# EAGLE schematic 12T_GAUGE_INPUT (EAGLE 9.1.3)
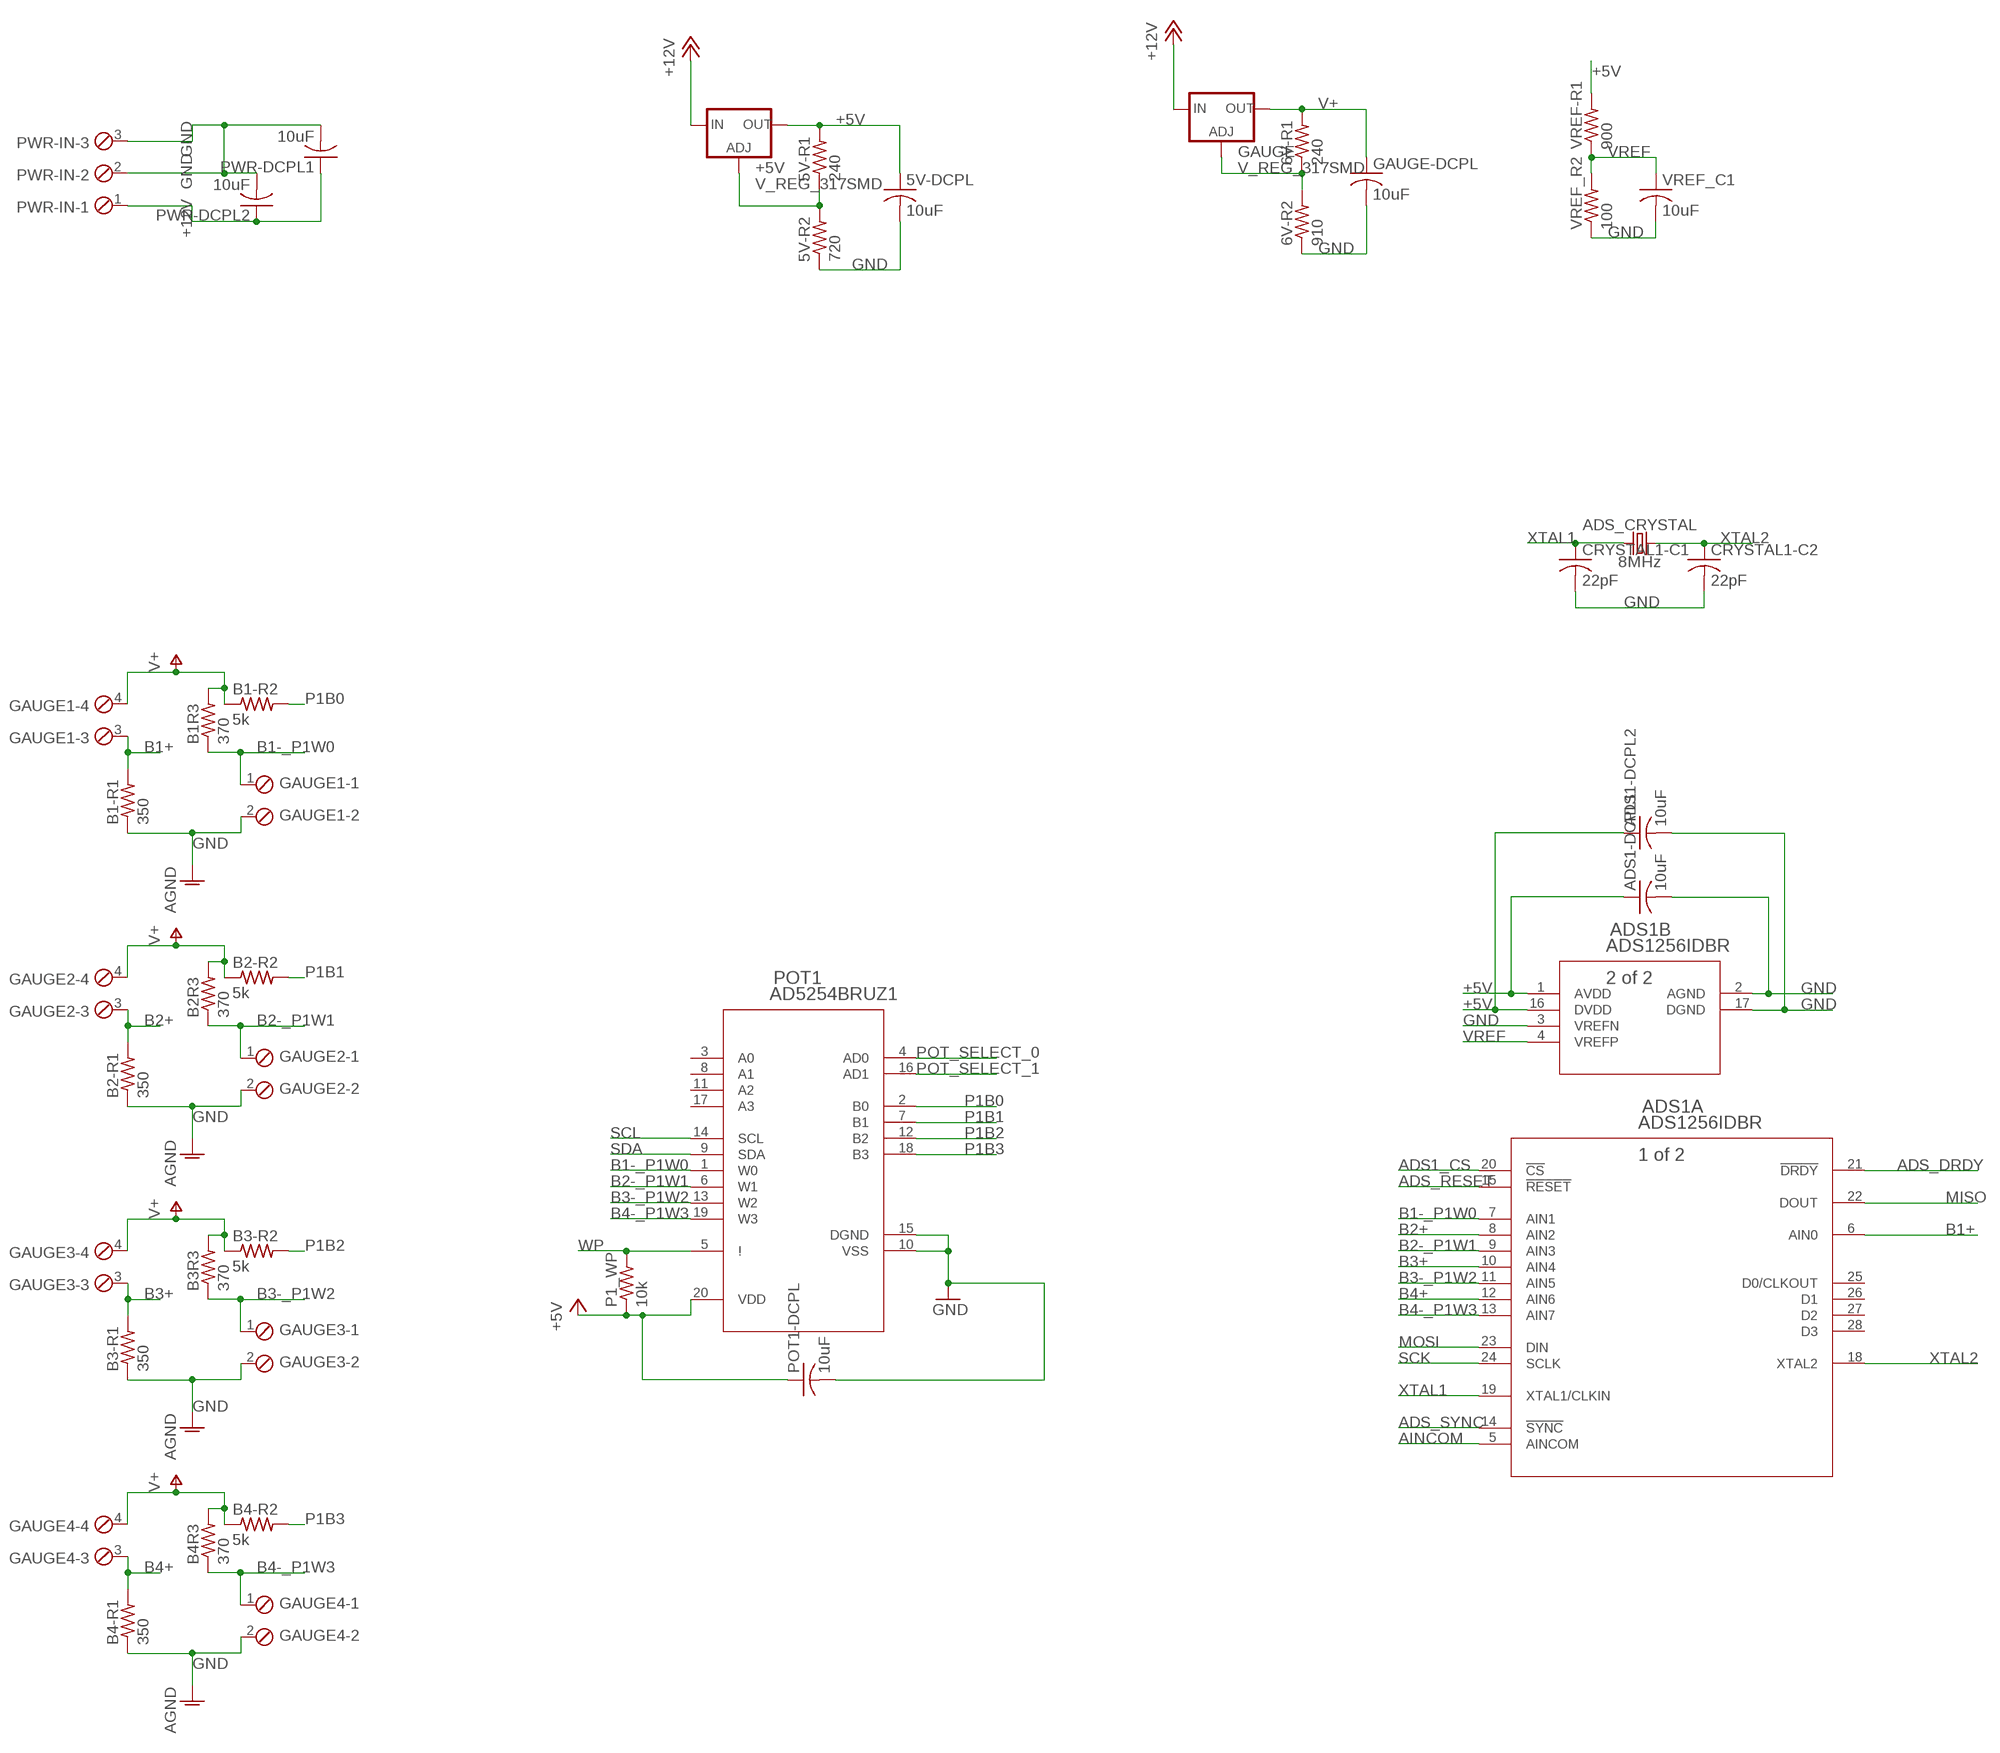
[diagram p0: schematic, sheet 1, part 1 of 3]
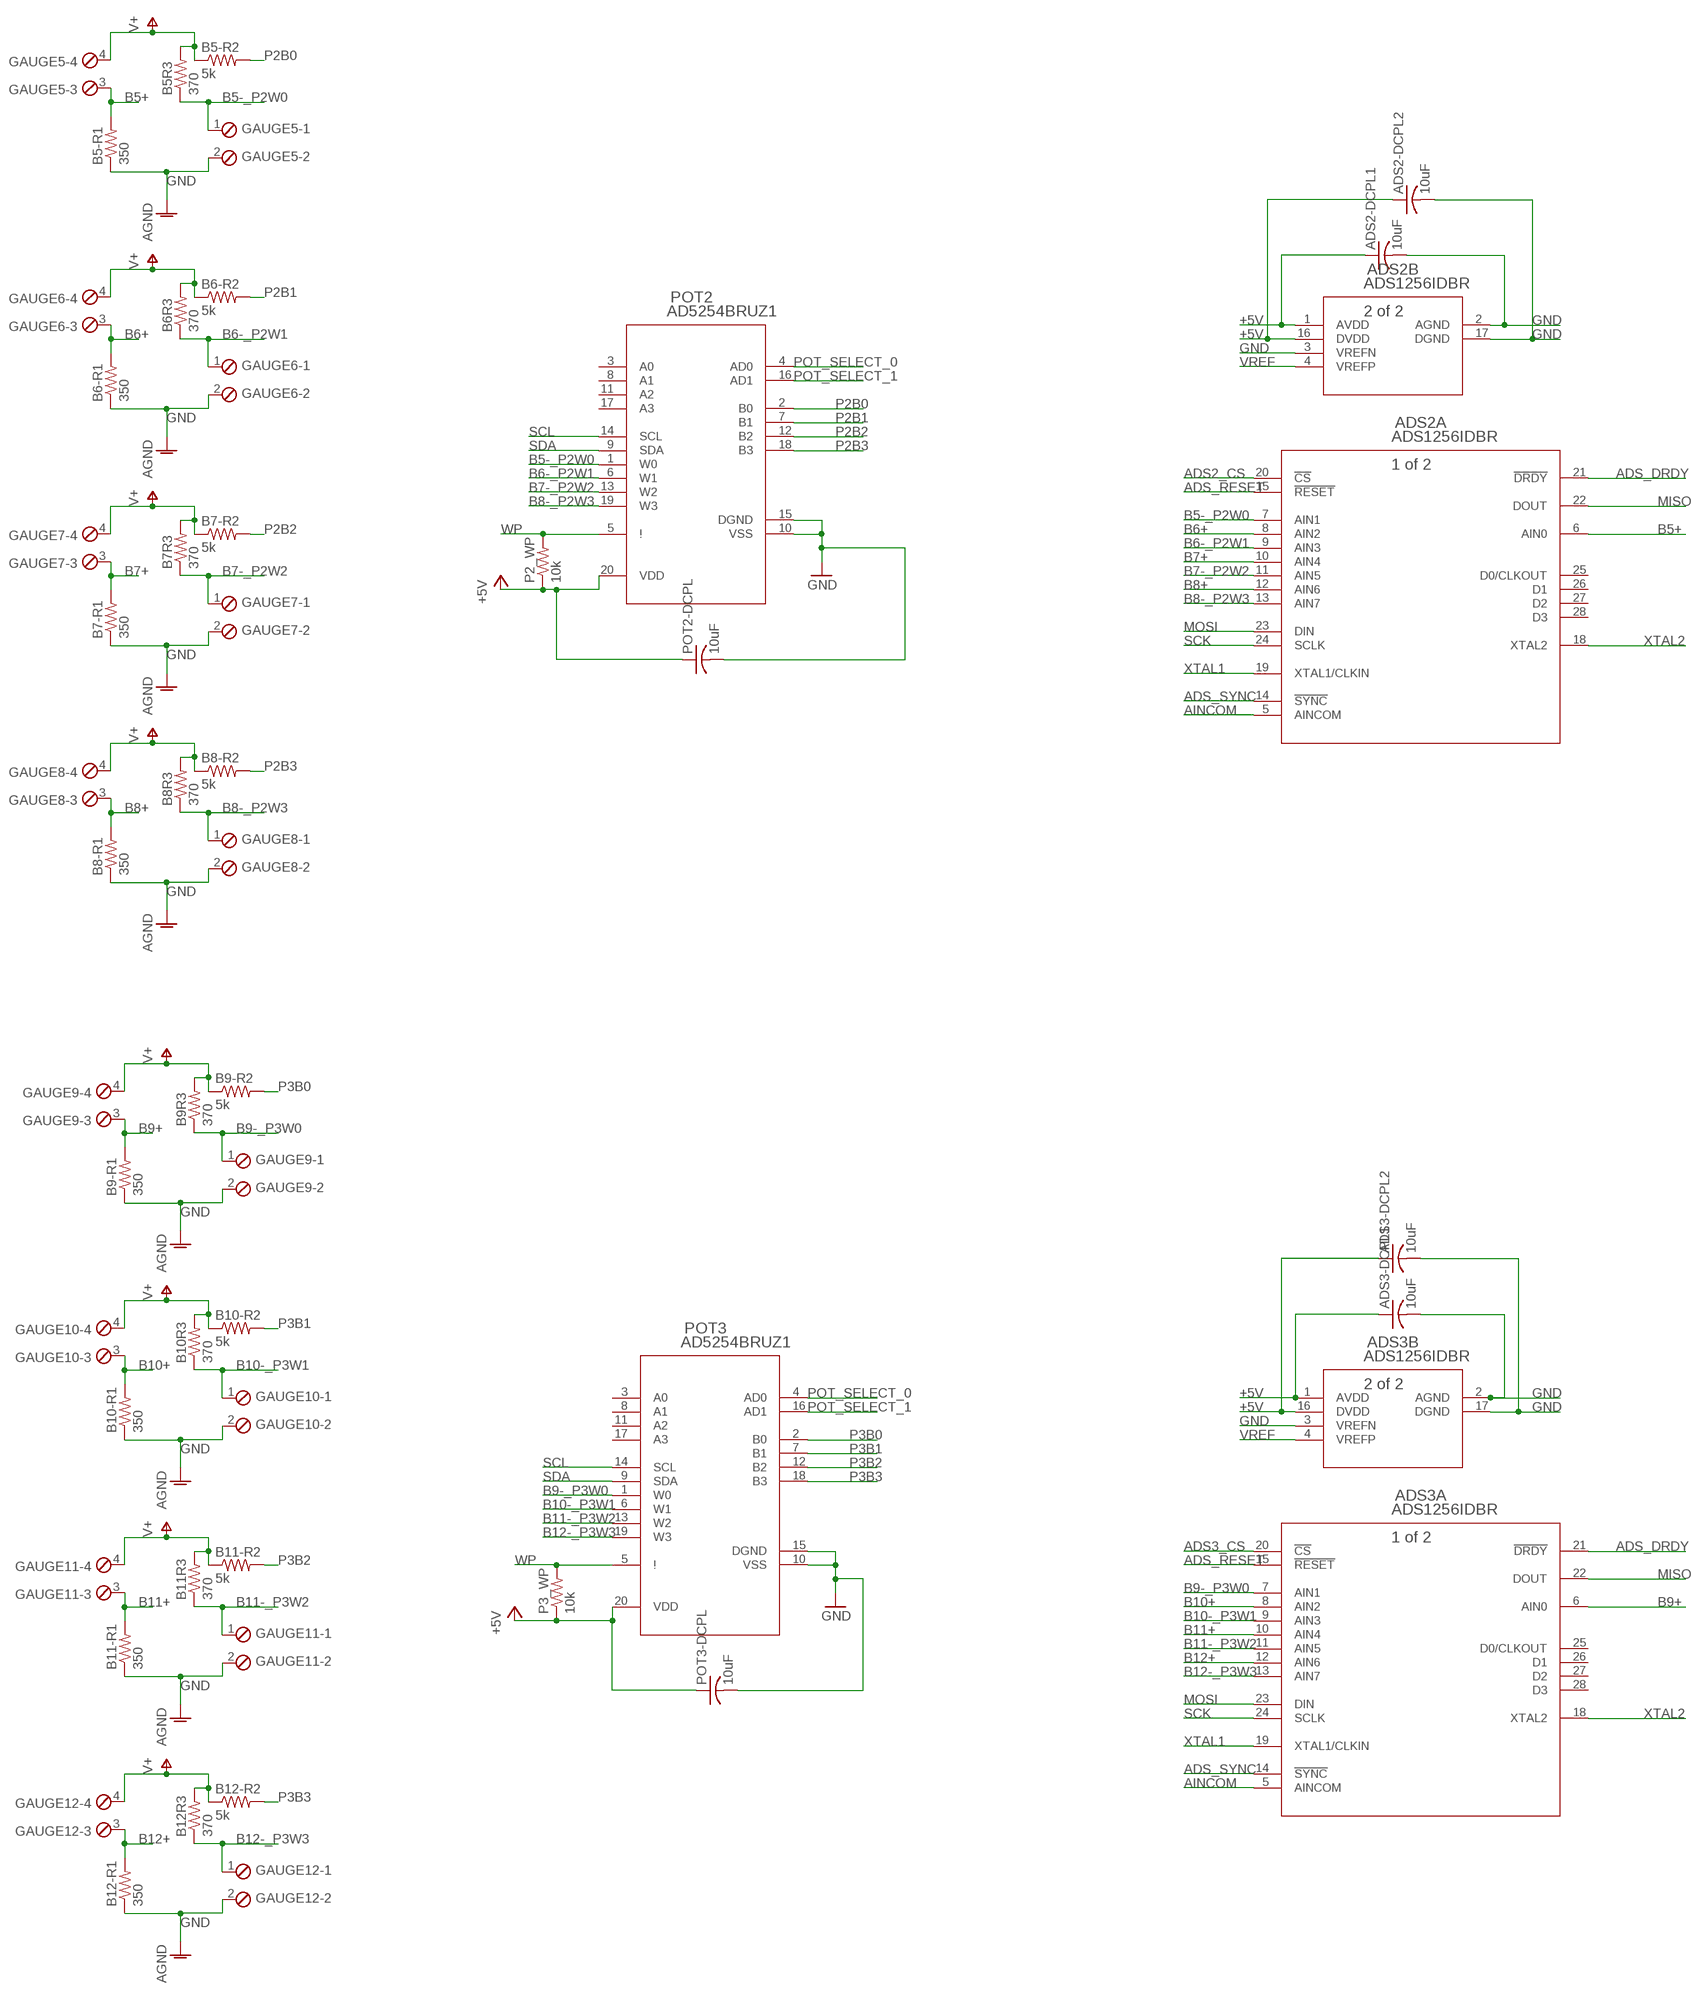
[diagram p1: schematic, sheet 1, part 2 of 3]
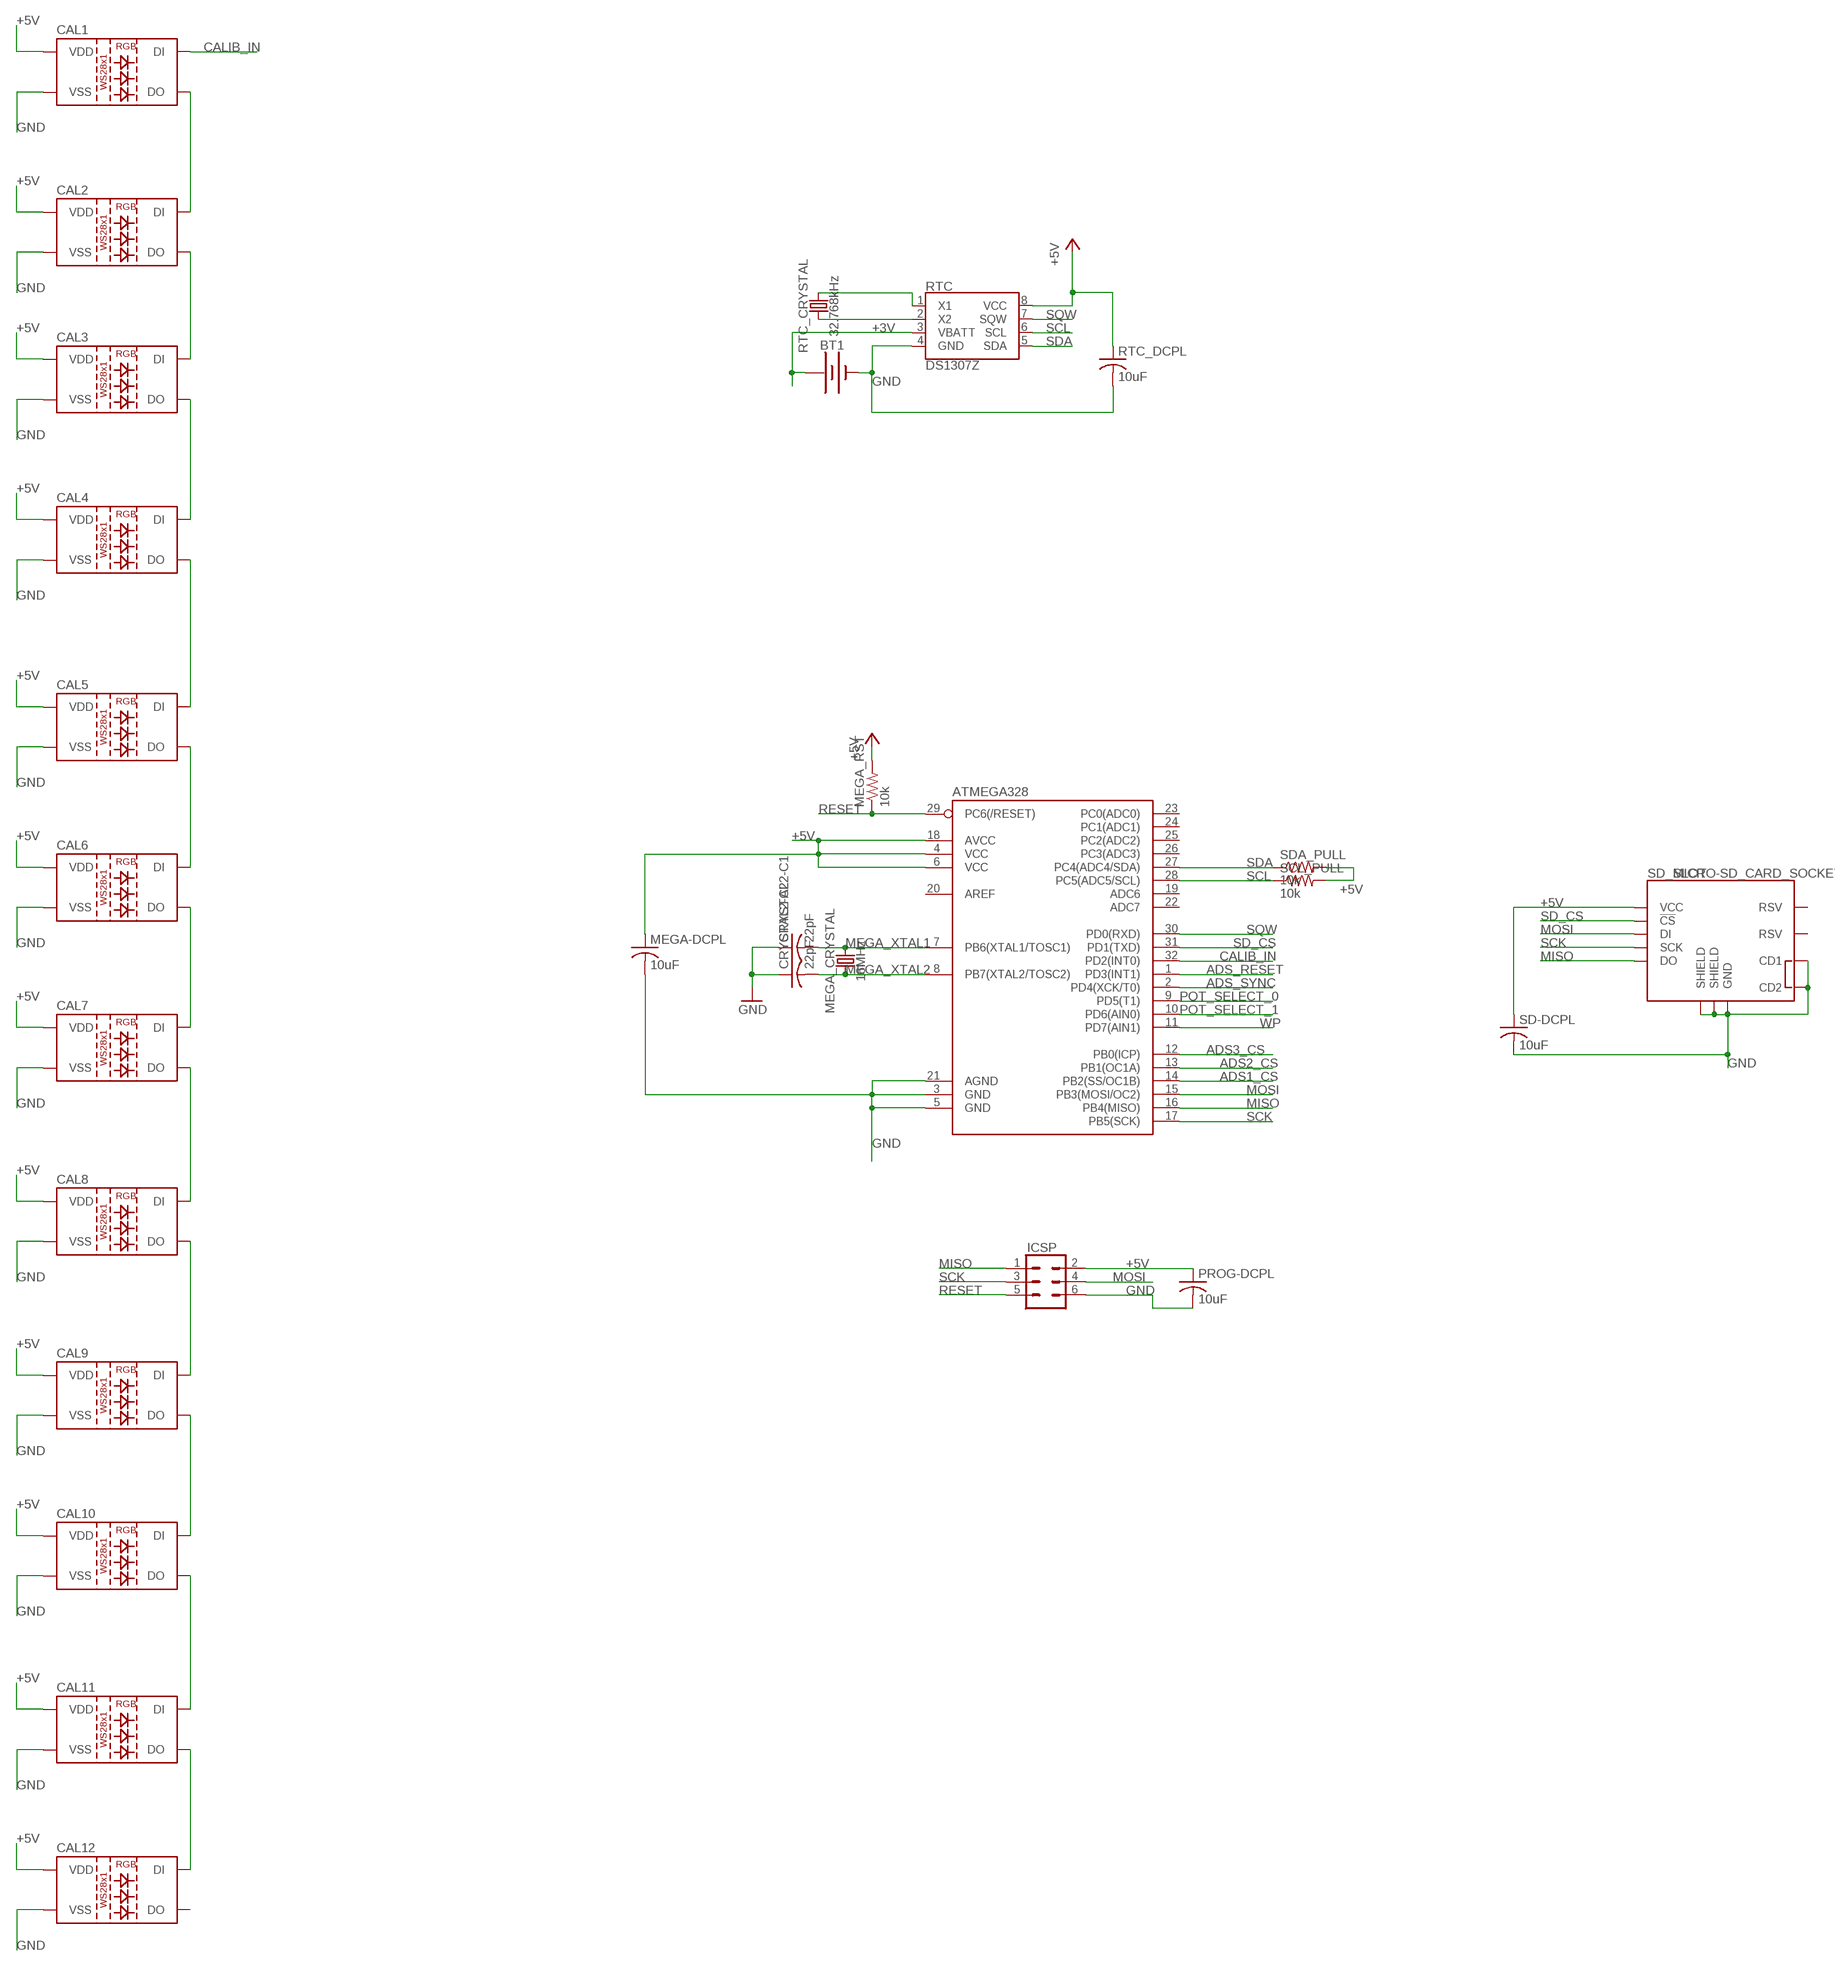
[diagram p2: schematic, sheet 1, part 3 of 3]

## Parts
5V-DCPL  10uF  C-USC1206  [C1206]
5V-R1  240  R-US_R1206  [R1206]
5V-R2  720  R-US_R1206  [R1206]
6V-R1  240  R-US_R1206  [R1206]
6V-R2  910  R-US_R1206  [R1206]
+5V  V_REG_317SMD  [SOT223]
ADS1  ADS1256IDBR  [DB28]
ADS1-DCPL1  10uF  C-USC1206  [C1206]
ADS1-DCPL2  10uF  C-USC1206  [C1206]
ADS2  ADS1256IDBR  [DB28]
ADS2-DCPL1  10uF  C-USC1206  [C1206]
ADS2-DCPL2  10uF  C-USC1206  [C1206]
ADS3  ADS1256IDBR  [DB28]
ADS3-DCPL1  10uF  C-USC1206  [C1206]
ADS3-DCPL2  10uF  C-USC1206  [C1206]
ADS_CRYSTAL  8MHz  CRYSTAL-8MHZSMD-5X3.2  [CRYSTAL-SMD-5X3.2-4PAD]
ATMEGA328  ATMEGA328P_TQFP  [TQFP32-08]
B1-R1  350  R-US_R1206  [R1206]
B1-R2  5k  R-US_R1206  [R1206]
B1R3  370  R-US_R1206  [R1206]
B2-R1  350  R-US_R1206  [R1206]
B2-R2  5k  R-US_R1206  [R1206]
B2R3  370  R-US_R1206  [R1206]
B3-R1  350  R-US_R1206  [R1206]
B3-R2  5k  R-US_R1206  [R1206]
B3R3  370  R-US_R1206  [R1206]
B4-R1  350  R-US_R1206  [R1206]
B4-R2  5k  R-US_R1206  [R1206]
B4R3  370  R-US_R1206  [R1206]
B5-R1  350  R-US_R1206  [R1206]
B5-R2  5k  R-US_R1206  [R1206]
B5R3  370  R-US_R1206  [R1206]
B6-R1  350  R-US_R1206  [R1206]
B6-R2  5k  R-US_R1206  [R1206]
B6R3  370  R-US_R1206  [R1206]
B7-R1  350  R-US_R1206  [R1206]
B7-R2  5k  R-US_R1206  [R1206]
B7R3  370  R-US_R1206  [R1206]
B8-R1  350  R-US_R1206  [R1206]
B8-R2  5k  R-US_R1206  [R1206]
B8R3  370  R-US_R1206  [R1206]
B9-R1  350  R-US_R1206  [R1206]
B9-R2  5k  R-US_R1206  [R1206]
B9R3  370  R-US_R1206  [R1206]
B10-R1  350  R-US_R1206  [R1206]
B10-R2  5k  R-US_R1206  [R1206]
B10R3  370  R-US_R1206  [R1206]
B11-R1  350  R-US_R1206  [R1206]
B11-R2  5k  R-US_R1206  [R1206]
B11R3  370  R-US_R1206  [R1206]
B12-R1  350  R-US_R1206  [R1206]
B12-R2  5k  R-US_R1206  [R1206]
B12R3  370  R-US_R1206  [R1206]
BT1  BATTERY-12MM_SMD  [BATTCON_12MM]
CAL1  WS2812"  [LED-TRICOLOR-5050-IC]
CAL2  WS2812"  [LED-TRICOLOR-5050-IC]
CAL3  WS2812"  [LED-TRICOLOR-5050-IC]
CAL4  WS2812"  [LED-TRICOLOR-5050-IC]
CAL5  WS2812"  [LED-TRICOLOR-5050-IC]
CAL6  WS2812"  [LED-TRICOLOR-5050-IC]
CAL7  WS2812"  [LED-TRICOLOR-5050-IC]
CAL8  WS2812"  [LED-TRICOLOR-5050-IC]
CAL9  WS2812"  [LED-TRICOLOR-5050-IC]
CAL10  WS2812"  [LED-TRICOLOR-5050-IC]
CAL11  WS2812"  [LED-TRICOLOR-5050-IC]
CAL12  WS2812"  [LED-TRICOLOR-5050-IC]
CRYSTAL1-C1  22pF  C-USC1206  [C1206]
CRYSTAL1-C2  22pF  C-USC1206  [C1206]
CRYSTAL2-C1  22pF  C-USC1206  [C1206]
CRYSTAL2-C2  22pF  C-USC1206  [C1206]
GAUGE  V_REG_317SMD  [SOT223]
GAUGE1  MPT4  [4POL254]
GAUGE2  MPT4  [4POL254]
GAUGE3  MPT4  [4POL254]
GAUGE4  MPT4  [4POL254]
GAUGE5  MPT4  [4POL254]
GAUGE6  MPT4  [4POL254]
GAUGE7  MPT4  [4POL254]
GAUGE8  MPT4  [4POL254]
GAUGE9  MPT4  [4POL254]
GAUGE10  MPT4  [4POL254]
GAUGE11  MPT4  [4POL254]
GAUGE12  MPT4  [4POL254]
GAUGE-DCPL  10uF  C-USC1206  [C1206]
ICSP  CONN_03X2FEMALE_SMD  [2X3_SMD]
MEGA-DCPL  10uF  C-USC1206  [C1206]
MEGA_CRYSTAL  16MHz  CRYSTAL-16MHZSMD-5X3.2  [CRYSTAL-SMD-5X3.2-4PAD]
MEGA_RST  10k  R-US_R1206  [R1206]
P1_WP  10k  R-US_R1206  [R1206]
P2_WP  10k  R-US_R1206  [R1206]
P3_WP  10k  R-US_R1206  [R1206]
POT1  AD5254BRUZ1  [RU_20]
POT1-DCPL  10uF  C-USC1206  [C1206]
POT2  AD5254BRUZ1  [RU_20]
POT2-DCPL  10uF  C-USC1206  [C1206]
POT3  AD5254BRUZ1  [RU_20]
POT3-DCPL  10uF  C-USC1206  [C1206]
PROG-DCPL  10uF  C-USC1206  [C1206]
PWR-DCPL1  10uF  C-USC1206  [C1206]
PWR-DCPL2  10uF  C-USC1206  [C1206]
PWR-IN  MPT3  [3POL254]
RTC  DS1307Z  [SO08-0.15]
RTC_CRYSTAL  32.768kHz  CRYSTAL-32.768KHZSMD-3.2X1.5  [CRYSTAL-SMD-3.2X1.5MM]
RTC_DCPL  10uF  C-USC1206  [C1206]
SCL_PULL  10k  R-US_R1206  [R1206]
SD-DCPL  10uF  C-USC1206  [C1206]
SD_SLOT  MICRO-SD_CARD_SOCKET  [MICRO-SD-SOCKET]
SDA_PULL  10k  R-US_R1206  [R1206]
VREF-R1  900  R-US_R1206  [R1206]
VREF_C1  10uF  C-USC1206  [C1206]
VREF_R2  100  R-US_R1206  [R1206]

## Nets
+3V: BT1.PWR@1(+) RTC.3(VBATT)
+5V: 5V-DCPL.1 5V-R1.2 +5V.2(OUT) ADS1-DCPL1.1 ADS1-DCPL2.1 ADS1.1(B:AVDD) ADS1.16(B:DVDD) ADS2-DCPL1.1 ADS2-DCPL2.1 ADS2.1(B:AVDD) ADS2.16(B:DVDD) ADS3-DCPL1.1 ADS3-DCPL2.1 ADS3.1(B:AVDD) ADS3.16(B:DVDD) ATMEGA328.4(VCC) ATMEGA328.6(VCC) ATMEGA328.18(AVCC) CAL1.3(VDD) CAL1.5(VDD) CAL2.3(VDD) CAL2.5(VDD) CAL3.3(VDD) CAL3.5(VDD) CAL4.3(VDD) CAL4.5(VDD) CAL5.3(VDD) CAL5.5(VDD) CAL6.3(VDD) CAL6.5(VDD) CAL7.3(VDD) CAL7.5(VDD) CAL8.3(VDD) CAL8.5(VDD) CAL9.3(VDD) CAL9.5(VDD) CAL10.3(VDD) CAL10.5(VDD) CAL11.3(VDD) CAL11.5(VDD) CAL12.3(VDD) CAL12.5(VDD) ICSP.2 MEGA-DCPL.1 MEGA_RST.2 P1_WP.1 P2_WP.1 P3_WP.1 POT1-DCPL.1 POT1.20(VDD) POT2-DCPL.1 POT2.20(VDD) POT3-DCPL.1 POT3.20(VDD) PROG-DCPL.1 RTC.8(VCC) RTC_DCPL.1 SCL_PULL.2 SD-DCPL.1 SD_SLOT.VCC SDA_PULL.2 VREF-R1.2
+12V: +5V.3(IN) GAUGE.3(IN) PWR-DCPL1.1 PWR-DCPL2.1 PWR-IN.1
ADS1_CS: ADS1.20(A:!CS) ATMEGA328.14(PB2(SS/OC1B))
ADS2_CS: ADS2.20(A:!CS) ATMEGA328.13(PB1(OC1A))
ADS3_CS: ADS3.20(A:!CS) ATMEGA328.12(PB0(ICP))
ADS_DRDY: ADS1.21(A:!DRDY) ADS2.21(A:!DRDY) ADS3.21(A:!DRDY)
ADS_RESET: ADS1.15(A:!RESET) ADS2.15(A:!RESET) ADS3.15(A:!RESET) ATMEGA328.1(PD3(INT1))
ADS_SYNC: ADS1.14(A:!SYNC) ADS2.14(A:!SYNC) ADS3.14(A:!SYNC) ATMEGA328.2(PD4(XCK/T0))
AINCOM: ADS1.5(A:AINCOM) ADS2.5(A:AINCOM) ADS3.5(A:AINCOM)
B1+: ADS1.6(A:AIN0) B1-R1.2 GAUGE1.3
B1-_P1W0: ADS1.7(A:AIN1) B1R3.1 GAUGE1.1 POT1.1(W0)
B2+: ADS1.8(A:AIN2) B2-R1.2 GAUGE2.3
B2-_P1W1: ADS1.9(A:AIN3) B2R3.1 GAUGE2.1 POT1.6(W1)
B3+: ADS1.10(A:AIN4) B3-R1.2 GAUGE3.3
B3-_P1W2: ADS1.11(A:AIN5) B3R3.1 GAUGE3.1 POT1.13(W2)
B4+: ADS1.12(A:AIN6) B4-R1.2 GAUGE4.3
B4-_P1W3: ADS1.13(A:AIN7) B4R3.1 GAUGE4.1 POT1.19(W3)
B5+: ADS2.6(A:AIN0) B5-R1.2 GAUGE5.3
B5-_P2W0: ADS2.7(A:AIN1) B5R3.1 GAUGE5.1 POT2.1(W0)
B6+: ADS2.8(A:AIN2) B6-R1.2 GAUGE6.3
B6-_P2W1: ADS2.9(A:AIN3) B6R3.1 GAUGE6.1 POT2.6(W1)
B7+: ADS2.10(A:AIN4) B7-R1.2 GAUGE7.3
B7-_P2W2: ADS2.11(A:AIN5) B7R3.1 GAUGE7.1 POT2.13(W2)
B8+: ADS2.12(A:AIN6) B8-R1.2 GAUGE8.3
B8-_P2W3: ADS2.13(A:AIN7) B8R3.1 GAUGE8.1 POT2.19(W3)
B9+: ADS3.6(A:AIN0) B9-R1.2 GAUGE9.3
B9-_P3W0: ADS3.7(A:AIN1) B9R3.1 GAUGE9.1 POT3.1(W0)
B10+: ADS3.8(A:AIN2) B10-R1.2 GAUGE10.3
B10-_P3W1: ADS3.9(A:AIN3) B10R3.1 GAUGE10.1 POT3.6(W1)
B11+: ADS3.10(A:AIN4) B11-R1.2 GAUGE11.3
B11-_P3W2: ADS3.11(A:AIN5) B11R3.1 GAUGE11.1 POT3.13(W2)
B12+: ADS3.12(A:AIN6) B12-R1.2 GAUGE12.3
B12-_P3W3: ADS3.13(A:AIN7) B12R3.1 GAUGE12.1 POT3.19(W3)
CALIB_IN: ATMEGA328.32(PD2(INT0)) CAL1.2(DI)
GND: 5V-DCPL.2 5V-R2.1 6V-R2.1 ADS1-DCPL1.2 ADS1-DCPL2.2 ADS1.2(B:AGND) ADS1.3(B:VREFN) ADS1.17(B:DGND) ADS2-DCPL1.2 ADS2-DCPL2.2 ADS2.2(B:AGND) ADS2.3(B:VREFN) ADS2.17(B:DGND) ADS3-DCPL1.2 ADS3-DCPL2.2 ADS3.2(B:AGND) ADS3.3(B:VREFN) ADS3.17(B:DGND) ATMEGA328.3(GND) ATMEGA328.5(GND) ATMEGA328.21(AGND) B1-R1.1 B2-R1.1 B3-R1.1 B4-R1.1 B5-R1.1 B6-R1.1 B7-R1.1 B8-R1.1 B9-R1.1 B10-R1.1 B11-R1.1 B12-R1.1 BT1.GND(-) CAL1.6(VSS) CAL2.6(VSS) CAL3.6(VSS) CAL4.6(VSS) CAL5.6(VSS) CAL6.6(VSS) CAL7.6(VSS) CAL8.6(VSS) CAL9.6(VSS) CAL10.6(VSS) CAL11.6(VSS) CAL12.6(VSS) CRYSTAL1-C1.2 CRYSTAL1-C2.2 CRYSTAL2-C1.1 CRYSTAL2-C2.1 GAUGE1.2 GAUGE2.2 GAUGE3.2 GAUGE4.2 GAUGE5.2 GAUGE6.2 GAUGE7.2 GAUGE8.2 GAUGE9.2 GAUGE10.2 GAUGE11.2 GAUGE12.2 GAUGE-DCPL.2 ICSP.6 MEGA-DCPL.2 POT1-DCPL.2 POT1.10(VSS) POT1.15(DGND) POT2-DCPL.2 POT2.10(VSS) POT2.15(DGND) POT3-DCPL.2 POT3.10(VSS) POT3.15(DGND) PROG-DCPL.2 PWR-DCPL1.2 PWR-DCPL2.2 PWR-IN.2 PWR-IN.3 RTC.4(GND) RTC_DCPL.2 SD-DCPL.2 SD_SLOT.CD1 SD_SLOT.CD2 SD_SLOT.GND SD_SLOT.GND1(SHIELD) SD_SLOT.GND3(SHIELD) VREF_C1.2 VREF_R2.1 ; supply symbol labelled AGND
MEGA_XTAL1: ATMEGA328.7(PB6(XTAL1/TOSC1)) CRYSTAL2-C1.2 MEGA_CRYSTAL.3
MEGA_XTAL2: ATMEGA328.8(PB7(XTAL2/TOSC2)) CRYSTAL2-C2.2 MEGA_CRYSTAL.1
MISO: ADS1.22(A:DOUT) ADS2.22(A:DOUT) ADS3.22(A:DOUT) ATMEGA328.16(PB4(MISO)) ICSP.1 SD_SLOT.DO
MOSI: ADS1.23(A:DIN) ADS2.23(A:DIN) ADS3.23(A:DIN) ATMEGA328.15(PB3(MOSI/OC2)) ICSP.4 SD_SLOT.DI
N$4: CAL1.1(DO) CAL2.2(DI)
N$5: 5V-R1.1 5V-R2.2 +5V.1(ADJ)
N$6: CAL2.1(DO) CAL3.2(DI)
N$7: CAL3.1(DO) CAL4.2(DI)
N$9: CAL4.1(DO) CAL5.2(DI)
N$10: CAL5.1(DO) CAL6.2(DI)
N$11: 6V-R1.1 6V-R2.2 GAUGE.1(ADJ)
N$12: CAL6.1(DO) CAL7.2(DI)
N$13: CAL7.1(DO) CAL8.2(DI)
N$14: CAL8.1(DO) CAL9.2(DI)
N$15: CAL9.1(DO) CAL10.2(DI)
N$16: CAL10.1(DO) CAL11.2(DI)
N$17: CAL11.1(DO) CAL12.2(DI)
N$19: RTC.1(X1) RTC_CRYSTAL.P$2
N$20: RTC.2(X2) RTC_CRYSTAL.P$1
P1B0: B1-R2.2 POT1.2(B0)
P1B1: B2-R2.2 POT1.7(B1)
P1B2: B3-R2.2 POT1.12(B2)
P1B3: B4-R2.2 POT1.18(B3)
P2B0: B5-R2.2 POT2.2(B0)
P2B1: B6-R2.2 POT2.7(B1)
P2B2: B7-R2.2 POT2.12(B2)
P2B3: B8-R2.2 POT2.18(B3)
P3B0: B9-R2.2 POT3.2(B0)
P3B1: B10-R2.2 POT3.7(B1)
P3B2: B11-R2.2 POT3.12(B2)
P3B3: B12-R2.2 POT3.18(B3)
POT_SELECT_0: ATMEGA328.9(PD5(T1)) POT1.4(AD0) POT2.4(AD0) POT3.4(AD0)
POT_SELECT_1: ATMEGA328.10(PD6(AIN0)) POT1.16(AD1) POT2.16(AD1) POT3.16(AD1)
RESET: ATMEGA328.29(PC6(/RESET)) ICSP.5 MEGA_RST.1
SCK: ADS1.24(A:SCLK) ADS2.24(A:SCLK) ADS3.24(A:SCLK) ATMEGA328.17(PB5(SCK)) ICSP.3 SD_SLOT.SCLK(SCK)
SCL: ATMEGA328.28(PC5(ADC5/SCL)) POT1.14(SCL) POT2.14(SCL) POT3.14(SCL) RTC.6(SCL) SCL_PULL.1
SD_CS: ATMEGA328.31(PD1(TXD)) SD_SLOT.CS(!CS)
SDA: ATMEGA328.27(PC4(ADC4/SDA)) POT1.9(SDA) POT2.9(SDA) POT3.9(SDA) RTC.5(SDA) SDA_PULL.1
SQW: ATMEGA328.30(PD0(RXD)) RTC.7(SQW)
V+: 6V-R1.2 B1-R2.1 B1R3.2 B2-R2.1 B2R3.2 B3-R2.1 B3R3.2 B4-R2.1 B4R3.2 B5-R2.1 B5R3.2 B6-R2.1 B6R3.2 B7-R2.1 B7R3.2 B8-R2.1 B8R3.2 B9-R2.1 B9R3.2 B10-R2.1 B10R3.2 B11-R2.1 B11R3.2 B12-R2.1 B12R3.2 GAUGE1.4 GAUGE2.4 GAUGE3.4 GAUGE4.4 GAUGE5.4 GAUGE6.4 GAUGE7.4 GAUGE8.4 GAUGE9.4 GAUGE10.4 GAUGE11.4 GAUGE12.4 GAUGE-DCPL.1 GAUGE.2(OUT)
VREF: ADS1.4(B:VREFP) ADS2.4(B:VREFP) ADS3.4(B:VREFP) VREF-R1.1 VREF_C1.1 VREF_R2.2
WP: ATMEGA328.11(PD7(AIN1)) P1_WP.2 P2_WP.2 P3_WP.2 POT1.5(!) POT2.5(!) POT3.5(!)
XTAL1: ADS1.19(A:XTAL1/CLKIN) ADS2.19(A:XTAL1/CLKIN) ADS3.19(A:XTAL1/CLKIN) ADS_CRYSTAL.1 CRYSTAL1-C1.1
XTAL2: ADS1.18(A:XTAL2) ADS2.18(A:XTAL2) ADS3.18(A:XTAL2) ADS_CRYSTAL.3 CRYSTAL1-C2.1
Unconnected: ADS1.25(A:D0/CLKOUT) ADS1.26(A:D1) ADS1.27(A:D2) ADS1.28(A:D3) ADS2.25(A:D0/CLKOUT) ADS2.26(A:D1) ADS2.27(A:D2) ADS2.28(A:D3) ADS3.25(A:D0/CLKOUT) ADS3.26(A:D1) ADS3.27(A:D2) ADS3.28(A:D3) ATMEGA328.19(ADC6) ATMEGA328.20(AREF) ATMEGA328.22(ADC7) ATMEGA328.23(PC0(ADC0)) ATMEGA328.24(PC1(ADC1)) ATMEGA328.25(PC2(ADC2)) ATMEGA328.26(PC3(ADC3)) CAL12.1(DO) POT1.3(A0) POT1.8(A1) POT1.11(A2) POT1.17(A3) POT2.3(A0) POT2.8(A1) POT2.11(A2) POT2.17(A3) POT3.3(A0) POT3.8(A1) POT3.11(A2) POT3.17(A3) SD_SLOT.RSV1(RSV) SD_SLOT.RSV2(RSV)

## Library data of the parts
5V-DCPL ADS1-DCPL1 ADS1-DCPL2 ADS2-DCPL1 ADS2-DCPL2 ADS3-DCPL1 ADS3-DCPL2 CRYSTAL1-C1 CRYSTAL1-C2 CRYSTAL2-C1 CRYSTAL2-C2 GAUGE-DCPL MEGA-DCPL POT1-DCPL POT2-DCPL POT3-DCPL PROG-DCPL PWR-DCPL1 PWR-DCPL2 RTC_DCPL SD-DCPL VREF_C1 = rcl:C-US: CAPACITOR, American symbol; SPICEPREFIX: C
5V-R1 5V-R2 6V-R1 6V-R2 B1-R1 B1-R2 B1R3 B2-R1 B2-R2 B2R3 B3-R1 B3-R2 B3R3 B4-R1 B4-R2 B4R3 B5-R1 B5-R2 B5R3 B6-R1 B6-R2 B6R3 B7-R1 B7-R2 B7R3 B8-R1 B8-R2 B8R3 B9-R1 B9-R2 B9R3 B10-R1 B10-R2 B10R3 B11-R1 B11-R2 B11R3 B12-R1 B12-R2 B12R3 MEGA_RST P1_WP P2_WP P3_WP SCL_PULL SDA_PULL VREF-R1 VREF_R2 = rcl:R-US_: RESISTOR, American symbol; SPICEPREFIX: R
+5V GAUGE = SparkFun-IC-Power:V_REG_317: Voltage Regulator Standard LM317 adjustable voltage regulator. AOI (Adjust Output Input). Google 'LM317 Calculator' for easy to use app to get the two resistor values needed. 240/720 for 5V output. 240/390 for 3.3V output. Spark Fun Electronics SKU : COM-00527
ADS1-ADS3 = ADS1256:ADS1256IDBR; MANUFACTURER_PART_NUMBER: ADS1256IDBR; VENDOR: Texas Instruments
ADS_CRYSTAL = SparkFun-Clocks:CRYSTAL-8MHZ: 8MHz Crystal Datasheet Example <http://www.futureelectronics.com/en/technologies/electromechanical/timing-devices/crystals/Pages/6008189-ABM3B-8.000MHZ-B2-T.aspx?IM=0> Frequency: 8MHz Frequency Tolerance: ±20ppm Load Capacitance: 18pF SparkFun Products: Pro Micro -3.3V/8MHz <https://www.sparkfun.com/products/12587> WAV Trigger <https://www.sparkfun.com/products/13660>; PROD_ID: XTAL-09431
ATMEGA328 = SparkFun-IC-Microcontroller:ATMEGA328P_TQFP: Popular 328P in QFP Storefront component: ATmega328 - TQFP <https://www.sparkfun.com/products/13448> (COM-13448) Datasheet <http://www.sparkfun.com/datasheets/Components/SMD/ATMega328.pdf> SparkFun Products SparkFun RedBoard - Programmed with Arduino <https://www.sparkfun.com/products/12757> (DEV-12757) Arduino Pro Mini 328 - 5V/16MHz <https://www.sparkfun.com/products/11113> (DEV-11113) Arduino Pro Mini 328 - 3.3V/8MHz <https://www.sparkfun.com/products/11114> (DEV-11114) SparkFun OpenLog <https://www.sparkfun.com/products/13712> (DEV-13712) SparkFun MicroView - OLED Arduino Module <https://www.sparkfun.com/products/12923> (DEV-12923) SparkFun Digital Sandbox <https://www.sparkfun.com/products/12651> (DEV-12651) SparkFun PicoBoard <https://www.sparkfun.com/products/11888> (WIG-11888) Arduino Fio <https://www.sparkfun.com/products/10116> (DEV-10116) LilyPad Arduino 328 Main Board <https://www.sparkfun.com/products/13342> (DEV-13342) SparkFun RedStick <https://www.sparkfun.com/products/13741> (DEV-13741) LilyPad MP3 <https://www.sparkfun.com/products/11013> (DEV-11013) LilyPad Arduino SimpleSnap <https://www.sparkfun.com/products/10941> (DEV-10941) SparkFun Stepoko <https://www.sparkfun.com/products/13899> (ROB-13899) SparkFun Geiger Counter <https://www.sparkfun.com/products/11345> (SEN-11345) SparkFun EL Sequencer <https://www.sparkfun.com/products/12781> (COM-12781) Arduino Pro 328 - 5V/16MHz <https://www.sparkfun.com/products/10915> (DEV-10915) CryptoCape <https://www.sparkfun.com/products/12773> (DEV-12773) SparkFun IR Thermometer Evaluation Board - MLX90614 <https://www.sparkfun.com/products/10740> (SEN-10740) SparkFun RedBot Mainboard <https://www.sparkfun.com/products/12097> (ROB-12097) Arduino Pro 328 - 3.3V/8MHz <https://www.sparkfun.com/products/10914> (DEV-10914) SparkFun Block for Intel® Edison - Arduino <https://www.sparkfun.com/products/13036> (DEV-13036) SparkFun Simon Says - Surface Mount Soldering Kit <https://www.sparkfun.com/products/10935> (KIT-10935) SparkFun 7-Segment Serial Display - Red <https://www.sparkfun.com/products/11441> (COM-11441) SparkFun 7-Segment Serial Display - White <https://www.sparkfun.com/products/11629> (COM-11629) SparkFun 7-Segment Serial Display - Yellow <https://www.sparkfun.com/products/11443> (COM-11443) SparkFun 7-Segment Serial Display - Kelly Green <https://www.sparkfun.com/products/11440> (COM-11440) SparkFun 7-Segment Serial Display - Blue <https://www.sparkfun.com/products/11442> (COM-11442) SparkFun OpenSegment Serial Display - 20mm (Blue) <https://www.sparkfun.com/products/11647> (COM-11647) SparkFun OpenSegment Serial Display - 20mm (Green) <https://www.sparkfun.com/products/11646> (COM-11646) SparkFun OpenSegment Serial Display - 20mm (White) <https://www.sparkfun.com/products/11648> (COM-11648) SparkFun OpenSegment Serial Display - 20mm (Red) <https://www.sparkfun.com/products/11644> (COM-11644) SparkFun OpenSegment Serial Display - 20mm (Yellow) <https://www.sparkfun.com/products/11645> (COM-11645) SparkFun OpenSegment Shield <https://www.sparkfun.com/products/13190> (DEV-13190); PROD_ID: IC-09069; VALUE: ATMEGA328P_TQFP
BT1 = SparkFun-Batteries:BATTERY: Battery - Single Cell A variety of battery chemistries, sizes, and footprints. Device List: 20MM_PTH - Coin Cell Battery Holder - 20mm (PTH) <https://www.sparkfun.com/products/783> 6.8MM_PTH - Coin Cell Battery Holder - 6.8MM(SMD) <https://www.digikey.com/product-detail/en/seiko-instruments/MS621FE-FL11E/728-1057-ND/1889208?WT.srch=1&gclid=CNOQ5a6LzdQCFZS2wAodXCkE0g> 12MM_SMD - Coin Cell Battery Holder - 12mm (SMD) <https://www.sparkfun.com/products/10592> 12MM_PTH - Coin Cell Battery Holder - 12mm (PTH) <https://www.sparkfun.com/products/7948> 20MM_SMD - 20mm Coin Cell Battery Holder (SMD) (2 legs) Used on the Big Time Watch Kit <https://www.sparkfun.com/products/11734> 20MM_SMD_4LEGS - Coin Cell Battery Holder - 20mm (SMD) <https://www.sparkfun.com/products/11892> 20MM_SMD_4LEGS_OVERPASTE - Coin Cell Battery Holder - 20mm (SMD) <https://www.sparkfun.com/products/11892> (Over-paste on the legs) 24.5MM_PTH - Coin Cell Battery Holder - 24.5mm (PTH) <https://www.sparkfun.com/products/8863> 9V - 9V Battery Holder - PC Mount Used on the SparkFun SparkPunk Sound Kit <https://www.sparkfun.com/products/11177> and SparkFun SparkPunk Sequencer Kit <https://www.sparkfun.com/products/12707> 18650 - Battery Holder - 18650 (PTH) <https://www.sparkfun.com/products/13113> AA - Battery Holder - 1xAA (PTH) <https://www.sparkfun.com/products/7949> AAA - Battery Holder - 1xAAA (PTH) <https://www.sparkfun.com/products/12718> AA_KIT - Battery Holder - 1xAA (PTH) <https://www.sparkfun.com/products/7949> Special kit package - pads only have exposed copper on one side of the board. AAA_KIT - Battery Holder - 1xAAA (PTH) <https://www.sparkfun.com/products/12718> Special kit package - pads only have exposed copper on one side of the board.; PROD_ID: BATT-08044; SF_SKU: PRT-10592
CAL1-CAL12 = SparkFun-LED:WS2812: WS2812 RGB LED w/ WS2811 driver 5x5mm SMD LED with built-in controller IC. Color: Red/Green/Blue mC Rating: RGB: 550, 1100, 200 mcd Current:RGB: 20, 20, 20 mA Forward Voltage: RGB: 1.8, 3.0, 3.2 V Packages:LED-TRICOLOR-5050-IC SparkFun Products: LED-SMD RGB (WS2812) <https://www.sparkfun.com/products/11821>; PROD_ID: DIO-11598; VALUE: WS2812
GAUGE1-GAUGE12 = con-phoenix-254:MPT4: PHOENIX CONNECTOR; OC_FARNELL: unknown; OC_NEWARK: unknown
ICSP = SparkFun-Connectors:CONN_03X2: Multi connection point. Often used as Generic Header-pin footprint for 0.1 inch spaced/style header connections You can populate with any combo of single row headers, but if you'd like an exact match, check these: Header - 2x3 (Male, 0.1") <https://www.sparkfun.com/products/12807> (PRT-12807) Header - 2x3 (Female, 0.1") <https://www.sparkfun.com/products/13010> (PRT-13010) 2x3 Pin Shrouded Header <https://www.sparkfun.com/products/10877> (PRT-10877) On any of the 0.1 inch spaced packages, you can populate with these: Break Away Headers - Straight <https://www.sparkfun.com/products/116> (PRT-00116) Break Away Male Headers - Right Angle <https://www.sparkfun.com/products/553> (PRT-00553) Female Headers <https://www.sparkfun.com/products/115> (PRT-00115) Break Away Headers - Machine Pin <https://www.sparkfun.com/products/117> (PRT-00117) Break Away Female Headers - Swiss Machine Pin <https://www.sparkfun.com/products/743> (PRT-00743) Special note: the shrouded connector mates well with our 3x2 ribbon cables: Ribbon Crimp Connector - 6-pin (2x3, Female) <https://www.sparkfun.com/products/10651> (PRT-10651) Ribbon Cable - 6 wire (15ft) <https://www.sparkfun.com/products/10646> (PRT-10646); PROD_ID: CONN-11290
MEGA_CRYSTAL = SparkFun-Clocks:CRYSTAL-16MHZ: 16MHz Crystal Digikey Example <http://www.digikey.com/product-search/en?keywords=535-9122-1-ND> Frequency: 16MHz Frequency Stability: ±50ppm Frequency Tolerance: ±20ppm Load Capacitance: 18pF SparkFun Products: Pro Micro -5V/16MHz <https://www.sparkfun.com/products/12640> SparkFun Serial Enabled LCD Kit <https://www.sparkfun.com/products/10097>; PROD_ID: XTAL-08218; SF_ID: COM-00094
POT1-POT3 = AD5254 Digital Potentiometer:AD5254BRUZ1; MANUFACTURER_PART_NUMBER: AD5254BRUZ1; VENDOR: Analog Devices Inc
PWR-IN = con-phoenix-254:MPT3: PHOENIX CONNECTOR; OC_FARNELL: unknown; OC_NEWARK: unknown
RTC = SparkFun-Clocks:DS1307: Maxim DS1307 - I2C Real-time clock (RTC) The DS1307 serial real-time clock (RTC) is a low-power, full binary-coded decimal (BCD) clock/calendar plus 56 bytes of NV SRAM. Address and data are transferred serially through an I2C, bidirectional bus. The clock/calendar provides seconds, minutes, hours, day, date, month, and year information. SparkFun Products: Real Time Clock Module <https://www.sparkfun.com/products/12708> (BOB-12708) Datasheet <https://cdn.sparkfun.com/datasheets/BreakoutBoards/DS1307.pdf>; PROD_ID: IC-08138
RTC_CRYSTAL = SparkFun-Clocks:CRYSTAL-32.768KHZ: 32.768kHz Crystal Frequency: 32.768kHz Frequency Stability: ±20ppm Load Capacitance: 12.5pF (PTH-2X6 & SMD-3.2X1.5), 6pF (SMD-2X6) SparkFun Products: SparkFun BigTime Watch Kit <https://www.sparkfun.com/products/11734> SparkFun nRF52832 Breakout <https://www.sparkfun.com/products/13990> SparkFun Real Time Clock Module <https://www.sparkfun.com/products/12708>; PROD_ID: XTAL-13062
SD_SLOT = SparkFun-Connectors:MICRO-SD_CARD_SOCKET: microSD Socket for Transflash Push-push type µSD socket. tDoc lines correctly indicate media card edge positions when inserting (unlocked, locked, depressed). NOTE: CD1 and CD2 are connected internally, and the default detect state of the socket is detect pin to ground. SparkFun Products: WAV Trigger <https://www.sparkfun.com/products/13660> CAN-Bus Shield <https://www.sparkfun.com/products/13262> SparkFun Level Shifing microSD Breakout <https://www.sparkfun.com/products/13743>; PROD_ID: CONN-07820; SF_ID: PRT-00127